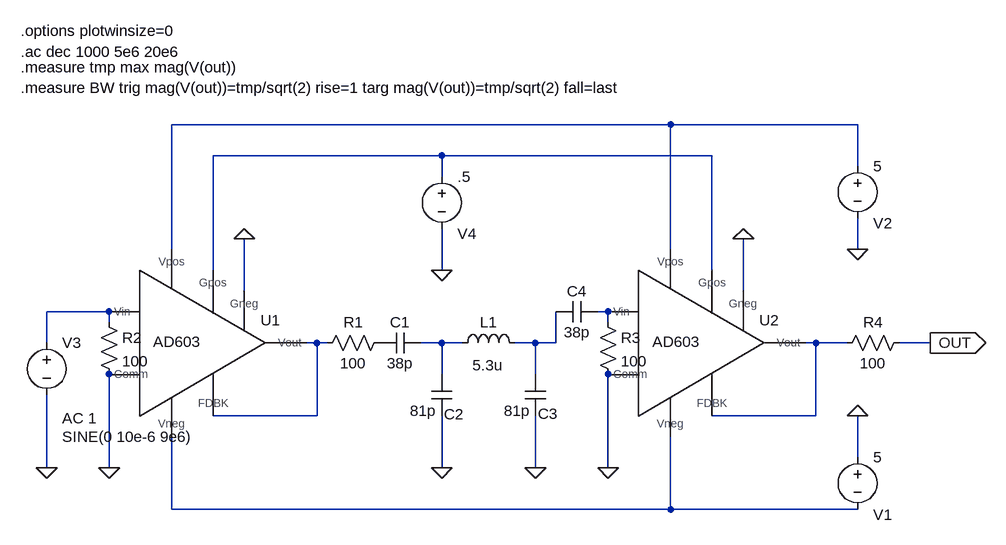
[diagram p0: schematic AD603_test.asc]
AD603_test.asc, the LTspice schematic file:
Version 4
SHEET 1 972 680
WIRE -1264 -352 -2032 -352
WIRE -976 -352 -1264 -352
WIRE -1616 -304 -1968 -304
WIRE -1200 -304 -1616 -304
WIRE -976 -288 -976 -352
WIRE -1616 -272 -1616 -304
WIRE -2032 -160 -2032 -352
WIRE -1264 -160 -1264 -352
WIRE -976 -160 -976 -208
WIRE -1968 -128 -1968 -304
WIRE -1616 -128 -1616 -192
WIRE -1200 -128 -1200 -304
WIRE -1920 -96 -1920 -176
WIRE -1152 -96 -1152 -176
WIRE -2128 -64 -2224 -64
WIRE -1360 -64 -1376 -64
WIRE -2128 -48 -2128 -64
WIRE -1360 -48 -1360 -64
WIRE -2224 -16 -2224 -64
WIRE -1808 -16 -1824 -16
WIRE -1792 -16 -1808 -16
WIRE -1616 -16 -1648 -16
WIRE -1584 -16 -1616 -16
WIRE -1472 -16 -1504 -16
WIRE -1440 -16 -1440 -64
WIRE -1440 -16 -1472 -16
WIRE -1040 -16 -1056 -16
WIRE -992 -16 -1040 -16
WIRE -864 -16 -912 -16
WIRE -1616 32 -1616 -16
WIRE -1472 32 -1472 -16
WIRE -1808 96 -1808 -16
WIRE -1808 96 -1968 96
WIRE -1040 96 -1040 -16
WIRE -1040 96 -1200 96
WIRE -976 160 -976 96
WIRE -2224 176 -2224 64
WIRE -2128 176 -2128 32
WIRE -1616 176 -1616 96
WIRE -1472 176 -1472 96
WIRE -1360 176 -1360 32
WIRE -2032 240 -2032 128
WIRE -1264 240 -1264 128
WIRE -1264 240 -2032 240
WIRE -976 240 -1264 240
FLAG -2128 176 0
FLAG -976 96 0
FLAG -976 -160 0
FLAG -2224 176 0
FLAG -864 -16 OUT
IOPIN -864 -16 Out
FLAG -1920 -176 0
FLAG -1616 176 0
FLAG -1472 176 0
FLAG -1616 -128 0
FLAG -1152 -176 0
FLAG -1360 176 0
SYMBOL voltage -976 144 R0
WINDOW 0 24 104 Left 2
WINDOW 3 24 16 Left 2
WINDOW 123 0 0 Left 2
WINDOW 39 0 0 Left 2
SYMATTR InstName V1
SYMATTR Value 5
SYMBOL voltage -976 -304 R0
WINDOW 0 24 104 Left 2
WINDOW 3 24 16 Left 2
WINDOW 123 0 0 Left 2
WINDOW 39 0 0 Left 2
SYMATTR InstName V2
SYMATTR Value 5
SYMBOL voltage -2224 -32 R0
WINDOW 123 24 132 Left 2
WINDOW 39 0 0 Left 2
WINDOW 3 24 160 Left 2
SYMATTR Value2 AC 1
SYMATTR Value SINE(0 10e-6 9e6)
SYMATTR InstName V3
SYMBOL cap -1648 -32 R90
WINDOW 0 0 32 VBottom 2
WINDOW 3 32 32 VTop 2
SYMATTR InstName C1
SYMATTR Value 38p
SYMBOL cap -1600 96 R180
WINDOW 0 -18 2 Left 2
WINDOW 3 24 8 Left 2
SYMATTR InstName C2
SYMATTR Value 81p
SYMBOL cap -1456 96 R180
WINDOW 0 -19 3 Left 2
WINDOW 3 24 8 Left 2
SYMATTR InstName C3
SYMATTR Value 81p
SYMBOL cap -1440 -48 R270
WINDOW 0 32 32 VTop 2
WINDOW 3 0 32 VBottom 2
SYMATTR InstName C4
SYMATTR Value 38p
SYMBOL ind -1600 0 R270
WINDOW 0 32 56 VTop 2
WINDOW 3 -3 55 VBottom 2
SYMATTR InstName L1
SYMATTR Value 5.3u
SYMBOL res -1696 -32 R90
WINDOW 0 0 56 VBottom 2
WINDOW 3 32 56 VTop 2
SYMATTR InstName R1
SYMATTR Value 100
SYMBOL voltage -1616 -288 R0
WINDOW 0 24 104 Left 2
WINDOW 3 24 16 Left 2
WINDOW 123 0 0 Left 2
WINDOW 39 0 0 Left 2
SYMATTR InstName V4
SYMATTR Value .5
SYMBOL ad603 -2016 -16 R0
WINDOW 3 -44 -2 Left 2
SYMATTR InstName U1
SYMBOL ad603 -1248 -16 R0
WINDOW 3 -44 -2 Left 2
SYMATTR InstName U2
SYMBOL res -896 -32 R90
WINDOW 0 0 56 VBottom 2
WINDOW 3 32 56 VTop 2
SYMATTR InstName R4
SYMATTR Value 100
SYMBOL res -2144 -64 R0
SYMATTR InstName R2
SYMATTR Value 100
SYMBOL res -1376 -64 R0
SYMATTR InstName R3
SYMATTR Value 100
TEXT -2264 -496 Left 2 !.options plotwinsize=0
TEXT -2264 -464 Left 2 !.ac dec 1000 5e6 20e6
TEXT -2264 -440 Left 2 !.measure tmp max mag(V(out))\n.measure BW trig mag(V(out))=tmp/sqrt(2) rise=1 targ mag(V(out))=tmp/sqrt(2) fall=last

The netlist it stands for:
* AD603_test.asc
V1 0 N009 5
V2 N001 0 5
V3 N003 0 SINE(0 10e-6 9e6) AC 1
C1 N006 P001 38p
C2 0 N006 81p
C3 0 N007 81p
C4 N007 N004 38p
L1 N006 N007 5.3u
R1 P001 N005 100
V4 N002 0 .5
XU1 N003 0 N001 N009 N005 N002 0 N005 AD603  ; pins Vin Comm Vpos Vneg Vout Gpos Gneg FDBK
XU2 N004 0 N001 N009 N008 N002 0 N008 AD603  ; pins Vin Comm Vpos Vneg Vout Gpos Gneg FDBK
R4 OUT N008 100
R2 N003 0 100
R3 N004 0 100
.options plotwinsize=0
.ac dec 1000 5e6 20e6
.measure tmp max mag(V(out))
.measure BW trig mag(V(out))=tmp/sqrt(2) rise=1 targ mag(V(out))=tmp/sqrt(2) fall=last
.lib AD603.CIR
.backanno
.end